# Altium schematic sheet Auth.SchDoc
size A; SheetNumber: 7; SheetTotal: 7
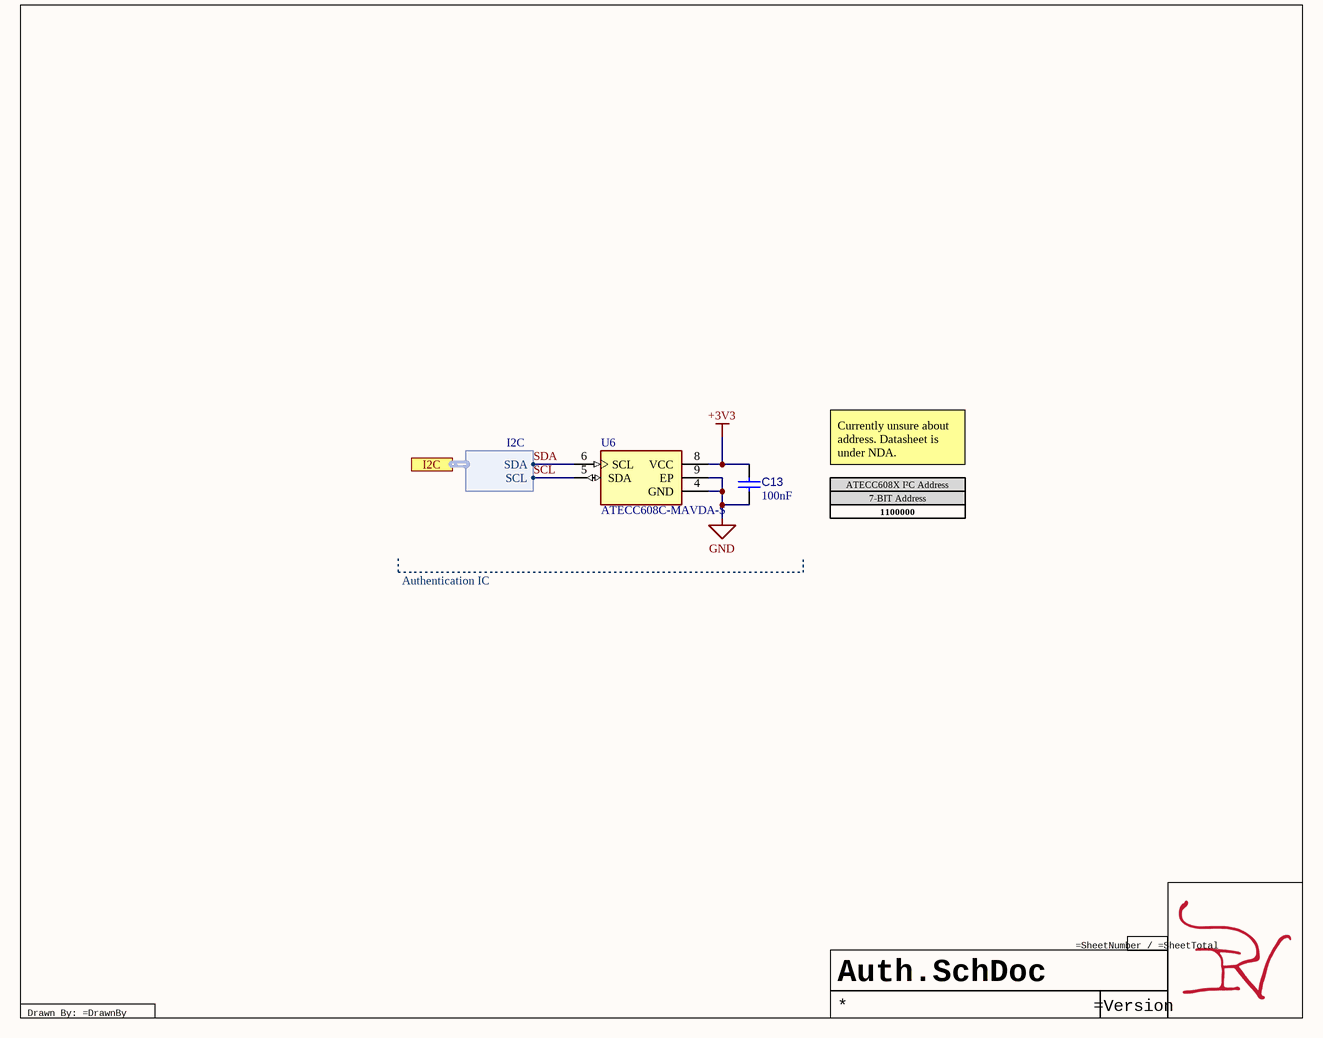
[diagram p0: Auth.SchDoc]

## Parts
C13  value 100nF  [CAP 0402_1005]  (hidden comment: CAP-NP-2)
U6  ATECC608C-MAVDA-S  [FP-C04-21355-Q4B-MFG]

## Ports
I2C (harness I2C)

## Harnesses
I2C: SDA, SCL

## Nets
+3V3: C13.1 U6.8(VCC)
GND: C13.2 U6.4(GND) U6.9(EP)
SCL: U6.5(SDA) ; port I2C.SCL
SDA: U6.6(SCL) ; port I2C.SDA

## Notes on the sheet
- 7-BIT Address
- ATECC608X I²C Address
- Currently unsure about address. Datasheet is under NDA.
- 1100000
- Authentication IC
- Drawn By: =DrawnBy

## Library data of the parts
C13 = CMP-00000-4: Ceramic Capacitor, Multilayer, Ceramic, 10V, 10% +Tol, 10% -Tol, X7R, 15% TC, 0.1uF, Surface Mount, 0402; Multilayer: Yes; Conflict Mineral: DRC Conflict Undeterminable; Global PFAS Assessment Status: Not Affected; Green: Compliant; NAS411: Affected; Rare Earth Element Information: Rare Earth Free; Capacitor Type: Ceramic; Case/Package: 0402; Dielectric Material: Ceramic; JESD-609 Code: e3; Max Operating Temperature: 125°C; Min Operating Temperature: -55°C; Mounting Technology: Surface Mount; Package Shape: Rectangular; Packaging: Tape and Reel; Pins: 2; Rated DC Voltage (URdc): 10V; Reach SVHC Compliant: Yes; RoHS Compliant: Yes; Temperature Characteristics Code: X7R; Terminal Finish: Nickel; Termination: Wraparound; Tolerance  (fill in as +-): 10%; Tolerance (fill in as +-): 10%; Tolerance: 10%; Voltage Rating: 10V; China RoHS Status: Unaffected; ELV: Compliant; EU SVHC List Version: Jan 23, 2024; Halogen Free: Compliant; Lead Free: Compliant; Persistent Organic Pollutants (POPs): Not Affected; REACH(SVHC) Information: Unaffected; RoHS Status: Yes; RoHS Version: 2011/65/EU, 2015/863; TSCA: Compliant; Capacitance: 100nF; Case Code (Imperial): 0402; Case Code (Metric): 1005; Construction: Flat; Contact Plating: Tin; Depth: 0.5mm; Dielectric: X7R; Height: 0.5mm; Length: 1mm; Mount: Surface Mount; Package Quantity: 1; Package Style: SMTMeter; Radiation Hardening: No; Series: CL; Thickness: 0.022inch; Width: 0.5mm
U6 = CMP-031-00009-5: ECC/ECDH, 100C, I2C, small 3K reel UDFN; RoHS Compliant: Yes